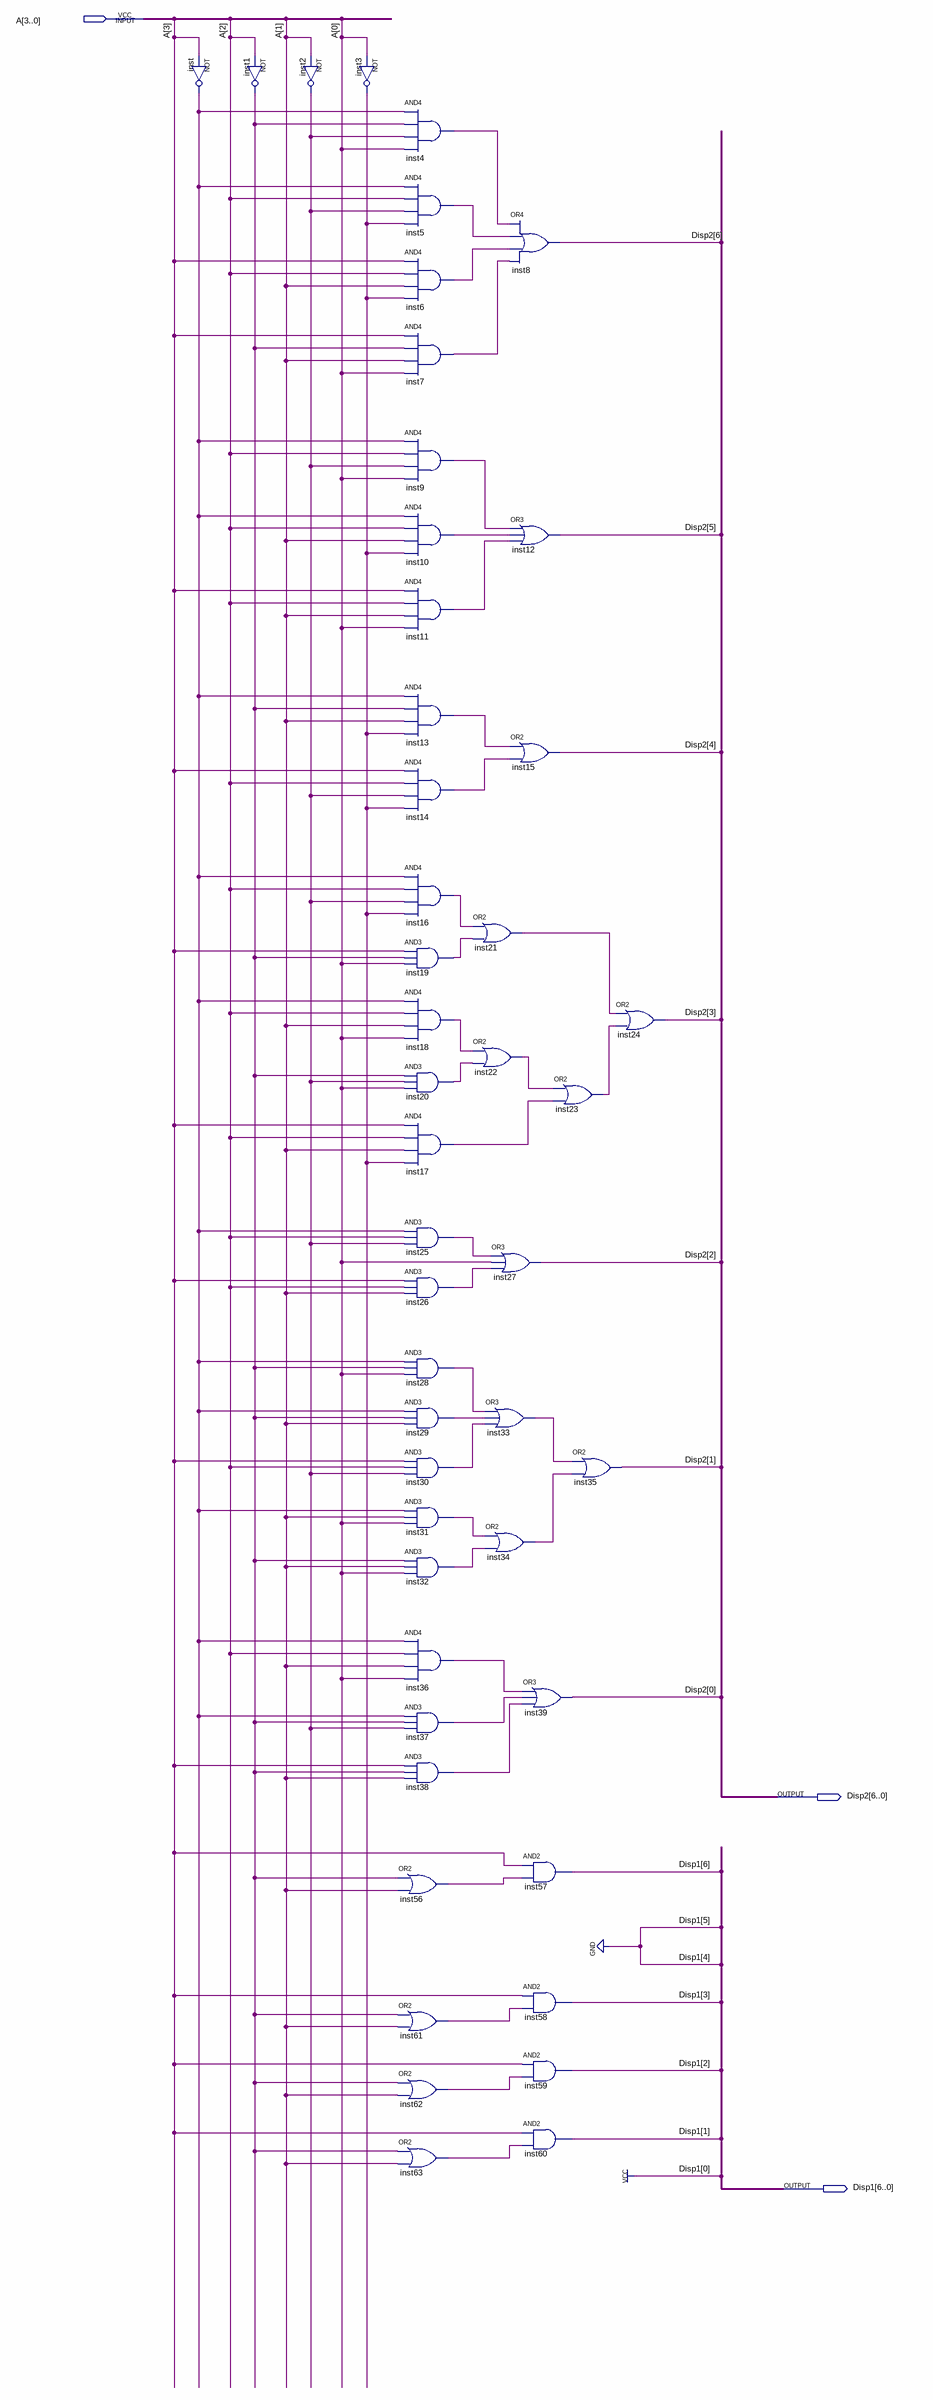
[diagram p0: schematic sheet]
// Quartus schematic DISPLAY-DIAGRAMA.bdf as structural Verilog: 48 symbols, 3 pins
module \DISPLAY-DIAGRAMA  (
  input  [3:0] A,
  output [6:0] Disp2,
  output [6:0] Disp1
);

  wire inst1_out, inst2_out, inst3_out, inst4_out, inst5_out, inst6_out, inst7_out, inst9_out, inst10_out,
       inst11_out, inst13_out, inst14_out, inst16_out, inst17_out, inst18_out, inst19_out, inst20_out,
       inst21_out, inst22_out, inst23_out, inst25_out, inst26_out, inst28_out, inst29_out, inst30_out,
       inst31_out, inst32_out, inst33_out, inst34_out, inst36_out, inst37_out, inst38_out, inst56_out,
       inst61_out, inst62_out, inst63_out, inst_out;

  not inst (inst_out, A[3]);
  not inst1 (inst1_out, A[2]);
  not inst2 (inst2_out, A[1]);
  not inst3 (inst3_out, A[0]);
  and inst4 (inst4_out, inst_out, inst1_out, inst2_out, A[0]);
  and inst5 (inst5_out, inst_out, A[2], inst2_out, inst3_out);
  and inst6 (inst6_out, A[3], A[2], A[1], inst3_out);
  and inst7 (inst7_out, A[3], inst1_out, A[1], A[0]);
  and inst9 (inst9_out, inst_out, A[2], inst2_out, A[0]);
  and inst10 (inst10_out, inst_out, A[2], A[1], inst3_out);
  and inst11 (inst11_out, A[3], A[2], A[1], A[0]);
  and inst13 (inst13_out, inst_out, inst1_out, A[1], inst3_out);
  and inst14 (inst14_out, A[3], A[2], inst2_out, inst3_out);
  and inst16 (inst16_out, inst_out, A[2], inst2_out, inst3_out);
  and inst19 (inst19_out, A[3], inst1_out, A[0]);
  and inst18 (inst18_out, inst_out, A[2], A[1], A[0]);
  and inst20 (inst20_out, inst1_out, inst2_out, A[0]);
  and inst17 (inst17_out, A[3], A[2], A[1], inst3_out);
  and inst25 (inst25_out, inst_out, A[2], inst2_out);
  and inst26 (inst26_out, A[3], A[2], A[1]);
  and inst28 (inst28_out, inst_out, inst1_out, A[0]);
  and inst29 (inst29_out, inst_out, inst1_out, A[1]);
  and inst30 (inst30_out, A[3], A[2], inst2_out);
  and inst31 (inst31_out, inst_out, A[1], A[0]);
  and inst32 (inst32_out, inst1_out, A[1], A[0]);
  and inst36 (inst36_out, inst_out, A[2], A[1], A[0]);
  and inst37 (inst37_out, inst_out, inst1_out, inst2_out);
  and inst38 (inst38_out, A[3], inst1_out, A[1]);
  or inst56 (inst56_out, inst1_out, A[1]);
  or inst61 (inst61_out, inst1_out, A[1]);
  or inst62 (inst62_out, inst1_out, A[1]);
  or inst63 (inst63_out, inst1_out, A[1]);
  or inst8 (Disp2[6], inst4_out, inst5_out, inst6_out, inst7_out);
  or inst12 (Disp2[5], inst9_out, inst10_out, inst11_out);
  or inst15 (Disp2[4], inst13_out, inst14_out);
  or inst21 (inst21_out, inst16_out, inst19_out);
  or inst22 (inst22_out, inst18_out, inst20_out);
  or inst27 (Disp2[2], inst25_out, A[0], inst26_out);
  or inst33 (inst33_out, inst28_out, inst29_out, inst30_out);
  or inst34 (inst34_out, inst31_out, inst32_out);
  or inst23 (inst23_out, inst22_out, inst17_out);
  or inst39 (Disp2[0], inst36_out, inst37_out, inst38_out);
  and inst57 (Disp1[6], A[3], inst56_out);
  and inst58 (Disp1[3], A[3], inst61_out);
  and inst59 (Disp1[2], A[3], inst62_out);
  and inst60 (Disp1[1], A[3], inst63_out);
  or inst35 (Disp2[1], inst33_out, inst34_out);
  or inst24 (Disp2[3], inst21_out, inst23_out);

  assign {Disp1[5:4], Disp1[0]} = 3'b001;
endmodule
